# EAGLE schematic ssb-shield (EAGLE 9.4.1)

## Sheet 1 of 2
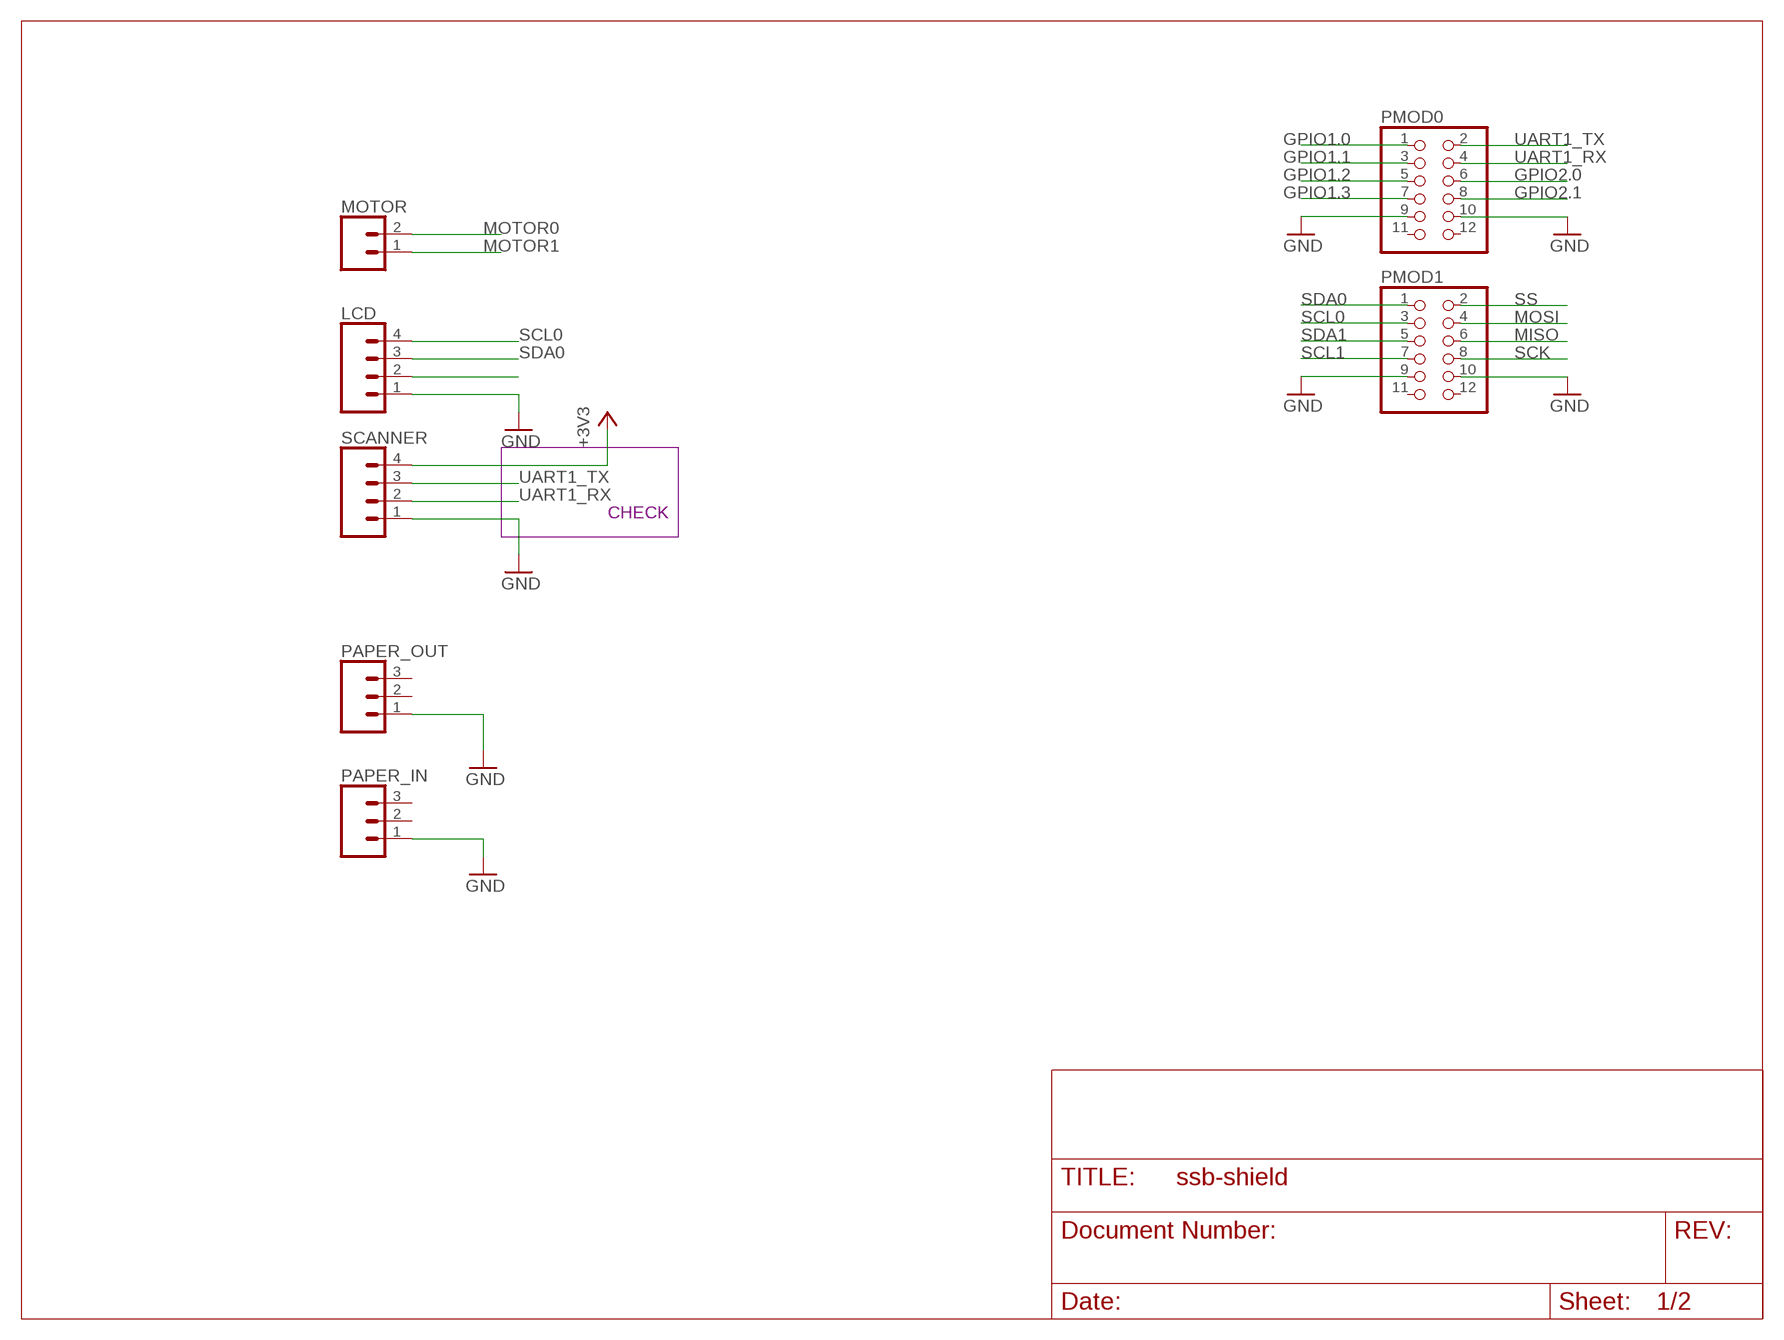
[diagram p0: schematic, sheet 1]

### Parts
LCD  CONN_04POLAR_LOCK  [MOLEX-1X4_LOCK]
MOTOR  CONN_02POLAR_LOCK  [MOLEX-1X2_LOCK]
PAPER_IN  CONN_03POLAR_LOCK  [MOLEX-1X3_LOCK]
PAPER_OUT  CONN_03POLAR_LOCK  [MOLEX-1X3_LOCK]
PMOD0  PINHD-2X6  [2X06]
PMOD1  PINHD-2X6  [2X06]
SCANNER  CONN_04POLAR_LOCK  [MOLEX-1X4_LOCK]

### Nets
+3V3: SCANNER.4 ; also sheet 2
GND: LCD.1 PAPER_IN.1 PAPER_OUT.1 PMOD0.9 PMOD0.10 PMOD1.9 PMOD1.10 SCANNER.1 ; also sheet 2
GPIO1.0: PMOD0.1
GPIO1.1: PMOD0.3
GPIO1.2: PMOD0.5
GPIO1.3: PMOD0.7
GPIO2.0: PMOD0.6
GPIO2.1: PMOD0.8
MISO: PMOD1.6
MOSI: PMOD1.4
MOTOR0: MOTOR.2
MOTOR1: MOTOR.1
N$3: LCD.2
SCK: PMOD1.8
SCL0: LCD.4 PMOD1.3
SCL1: PMOD1.7
SDA0: LCD.3 PMOD1.1
SDA1: PMOD1.5
SS: PMOD1.2
UART1_RX: PMOD0.4 SCANNER.2
UART1_TX: PMOD0.2 SCANNER.3
Unconnected: PAPER_IN.2 PAPER_IN.3 PAPER_OUT.2 PAPER_OUT.3 PMOD0.11 PMOD0.12 PMOD1.11 PMOD1.12

### Notes on the sheet
- CHECK

## Sheet 2 of 2
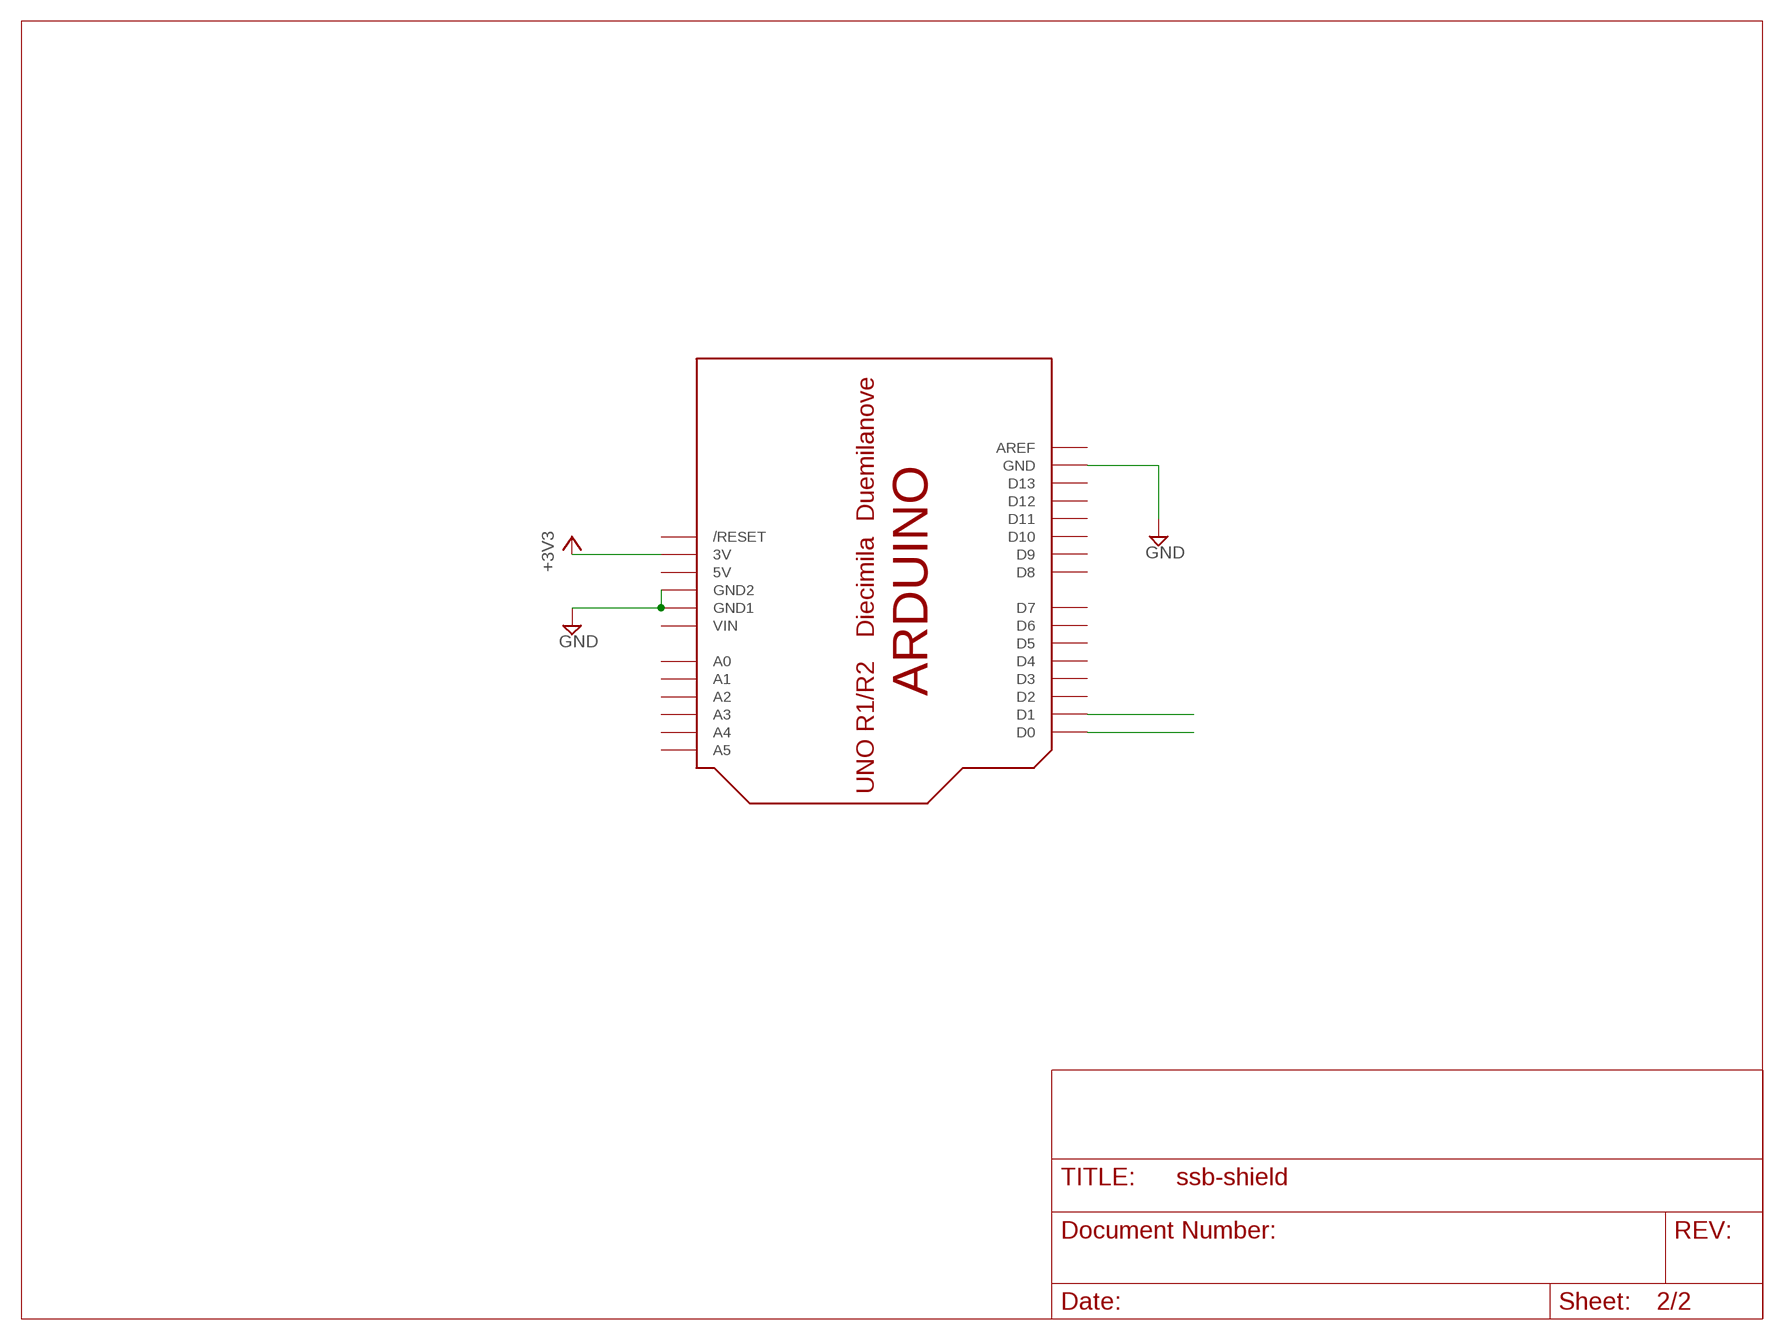
[diagram p1: schematic, sheet 2]

### Parts
U$2  ARDUINO-NOHOLE  [ARDUINO-NOHOLE]

### Nets
+3V3: U$2.3V ; also sheet 1
GND: U$2.GND U$2.GND1 U$2.GND2 ; also sheet 1
N$1: U$2.D0
N$2: U$2.D1
Unconnected: U$2.A0 U$2.A1 U$2.A2 U$2.A3 U$2.A4 U$2.A5 U$2.AREF U$2.D2 U$2.D3 U$2.D4 U$2.D5 U$2.D6 U$2.D7 U$2.D8 U$2.D9 U$2.D10 U$2.D11 U$2.D12 U$2.D13 U$2.RESET(/RESET)

## Power pins joined to a net without a drawn wire
5V: U$2.5V
VIN: U$2.VIN

## Library data of the parts
LCD SCANNER = SparkFun-Connectors:CONN_04: Multi connection point. Often used as Generic Header-pin footprint for 0.1 inch spaced/style header connections On any of the 0.1 inch spaced packages, you can populate with these: Break Away Headers - Straight <https://www.sparkfun.com/products/116> (PRT-00116) Break Away Male Headers - Right Angle <https://www.sparkfun.com/products/553> (PRT-00553) Female Headers <https://www.sparkfun.com/products/115> (PRT-00115) Break Away Headers - Machine Pin <https://www.sparkfun.com/products/117> (PRT-00117) Break Away Female Headers - Swiss Machine Pin <https://www.sparkfun.com/products/743> (PRT-00743) For SCREWTERMINALS and SPRING TERMINALS visit here: Screw Terimnals on SparkFun.com <https://www.sparkfun.com/search/results?term=Screw+Terminals> (5mm/3.5mm/2.54mm spacing) This device is also useful as a general connection point to wire up your design to another part of your project. Our various solder wires solder well into these plated through hole pads. Hook-Up Wire - Assortment (Stranded, 22 AWG) <https://www.sparkfun.com/products/11375> (PRT-11375) Hook-Up Wire - Assortment (Solid Core, 22 AWG) <https://www.sparkfun.com/products/11367> (PRT-11367) View the entire wire category on our website here <https://www.sparkfun.com/categories/141> Special notes: Molex polarized connector foot print use with SKU : PRT-08231 with associated crimp pins and housings. 1MM SMD Version SKU: PRT-10208; PROD_ID: CONN-08186; SF_ID: PRT-08231
MOTOR = SparkFun-Connectors:CONN_02: Multi connection point. Often used as Generic Header-pin footprint for 0.1 inch spaced/style header connections On any of the 0.1 inch spaced packages, you can populate with these: Break Away Headers - Straight <https://www.sparkfun.com/products/116> (PRT-00116) Break Away Male Headers - Right Angle <https://www.sparkfun.com/products/553> (PRT-00553) Female Headers <https://www.sparkfun.com/products/115> (PRT-00115) Break Away Headers - Machine Pin <https://www.sparkfun.com/products/117> (PRT-00117) Break Away Female Headers - Swiss Machine Pin <https://www.sparkfun.com/products/743> (PRT-00743) For SCREWTERMINALS and SPRING TERMINALS visit here: Screw Terimnals on SparkFun.com <https://www.sparkfun.com/search/results?term=Screw+Terminals> (5mm/3.5mm/2.54mm spacing) This device is also useful as a general connection point to wire up your design to another part of your project. Our various solder wires solder well into these plated through hole pads. Hook-Up Wire - Assortment (Stranded, 22 AWG) <https://www.sparkfun.com/products/11375> (PRT-11375) Hook-Up Wire - Assortment (Solid Core, 22 AWG) <https://www.sparkfun.com/products/11367> (PRT-11367) View the entire wire category on our website here <https://www.sparkfun.com/categories/141> Special notes: Molex polarized connector foot print use with: PRT-08233 with associated crimp pins and housings. 2.54_SCREWTERM for use with PRT-10571. 3.5mm Screw Terminal footprints for PRT-08084 5mm Screw Terminal footprints for use with PRT-08432; SF_ID: PRT-09918
PAPER_IN PAPER_OUT = SparkFun-Connectors:CONN_03: Multi connection point. Often used as Generic Header-pin footprint for 0.1 inch spaced/style header connections On any of the 0.1 inch spaced packages, you can populate with these: Break Away Headers - Straight <https://www.sparkfun.com/products/116> (PRT-00116) Break Away Male Headers - Right Angle <https://www.sparkfun.com/products/553> (PRT-00553) Female Headers <https://www.sparkfun.com/products/115> (PRT-00115) Break Away Headers - Machine Pin <https://www.sparkfun.com/products/117> (PRT-00117) Break Away Female Headers - Swiss Machine Pin <https://www.sparkfun.com/products/743> (PRT-00743) Stackable Header - 3 Pin (Female, 0.1") <https://www.sparkfun.com/products/13875> (PRT-13875) For SCREWTERMINALS and SPRING TERMINALS visit here: Screw Terimnals on SparkFun.com <https://www.sparkfun.com/search/results?term=Screw+Terminals> (5mm/3.5mm/2.54mm spacing) This device is also useful as a general connection point to wire up your design to another part of your project. Our various solder wires solder well into these plated through hole pads. Hook-Up Wire - Assortment (Stranded, 22 AWG) <https://www.sparkfun.com/products/11375> (PRT-11375) Hook-Up Wire - Assortment (Solid Core, 22 AWG) <https://www.sparkfun.com/products/11367> (PRT-11367) View the entire wire category on our website here <https://www.sparkfun.com/categories/141> Special notes: Molex polarized connector foot print use with SKU : PRT-08232 with associated crimp pins and housings.; PROD_ID: CONN-08625; SF_ID: PRT-08096
PMOD0 PMOD1 = pinhead:PINHD-2X6: PIN HEADER
U$2 = adafruit:ARDUINO: Arduino Diecimila/Duemilanove Make a shield with ease, this package has all the named pins as well as the two mounting drill holes and an outline of the USB and DC power connector. The outline is on the DIMENSION layer, so if your board house uses it they will cut the outline to match. http://www.ladyada.net/library/pcb/eaglelibrary.html